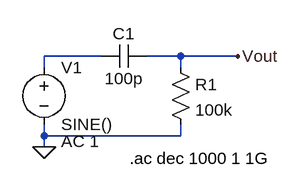
[diagram p0: schematic HPF.asc]
HPF.asc, the LTspice schematic file:
Version 4
SHEET 1 880 680
WIRE 160 80 80 80
WIRE 272 80 224 80
WIRE 352 80 272 80
WIRE 80 96 80 80
WIRE 272 96 272 80
WIRE 80 192 80 176
WIRE 272 192 272 176
WIRE 272 192 80 192
WIRE 80 208 80 192
FLAG 80 208 0
FLAG 352 80 Vout
SYMBOL cap 224 64 R90
WINDOW 0 0 32 VBottom 2
WINDOW 3 32 32 VTop 2
SYMATTR InstName C1
SYMATTR Value 100p
SYMBOL res 256 80 R0
SYMATTR InstName R1
SYMATTR Value 100k
SYMBOL voltage 80 80 R0
WINDOW 123 24 120 Left 2
WINDOW 39 0 0 Left 0
SYMATTR InstName V1
SYMATTR Value SINE()
SYMATTR Value2 AC 1
TEXT 200 224 Left 2 !.ac dec 1000 1 1G

The netlist it stands for:
* HPF.asc
C1 Vout N001 100p
R1 Vout 0 100k
V1 N001 0 SINE() AC 1
.ac dec 1000 1 1G
.backanno
.end